# Altium schematic sheet MPU6050.SchDoc
size A4
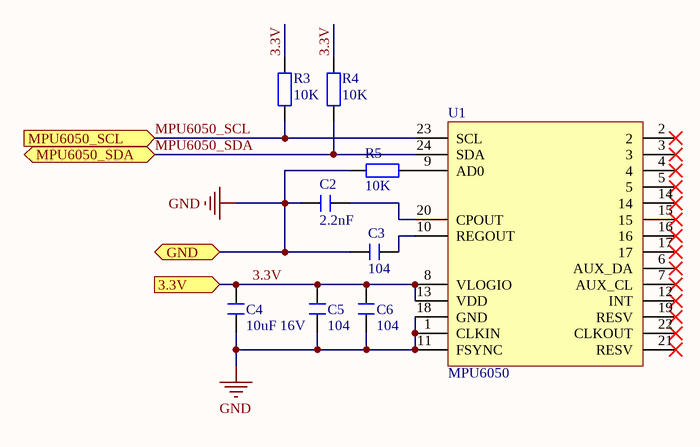
[diagram p0: MPU6050.SchDoc]

## Parts
C2  2.2nF  [C 0603_L]
C3  104  [C 0603_L]
C4  10uF 16V  [C 0603_L]
C5  104  [C 0603_L]
C6  104  [C 0603_L]
R3  10K  [R 0603_L]
R4  10K  [R 0603_L]
R5  10K  [R 0603_L]
U1  MPU6050  [QFN24 4x4_N]

## Ports
3.3V (in), GND, MPU6050_SCL (in), MPU6050_SDA

## Nets
GND: C2.1 C3.1 C4.2 C5.2 C6.2 R5.1 U1.1(CLKIN) U1.11(FSYNC) U1.18(GND) ; port GND
3.3V: C4.1 C5.1 C6.1 R3.1 R4.1 U1.8(VLOGIO) U1.13(VDD) ; port 3.3V
MPU6050_SCL: R3.2 U1.23(SCL) ; port MPU6050_SCL
MPU6050_SDA: R4.2 U1.24(SDA) ; port MPU6050_SDA
NetC2_2: C2.2 U1.20(CPOUT)
NetC3_2: C3.2 U1.10(REGOUT)
NetR5_2: R5.2 U1.9(AD0)

Not connected (* = marked no-connect by the designer): U1 2* 3* 4* 5* 6(AUX_DA)* 7(AUX_CL)* 12(INT)* 14* 15* 16* 17* 19(RESV)* 21(RESV)* 22(CLKOUT)*

## Library data of the parts
C2-C6 = C: 贴片电容; BOM名称: 无极性贴片电容; 优秀评价可免费更新: 联系淘宝ID：黄晶宝石，获取更新版封装库; 卖家免费技术支持，联系售后: 唯一出售店铺网址https://shop463601444.taobao.com; 本封装库来自淘宝卖家 ID：黄晶宝石: 其他店铺购入均为盗版，请立即申请退款
R3-R5 = R: 贴片电阻; 优秀评价可免费更新: 联系淘宝ID：黄晶宝石，获取更新版封装库; 卖家免费技术支持，联系售后: 唯一出售店铺网址https://shop463601444.taobao.com; 本封装库来自淘宝卖家 ID：黄晶宝石: 其他店铺购入均为盗版，请立即申请退款; BOM名称: 贴片电阻
U1 = MPU6050: 三轴加速度+三轴陀螺仪; 优秀评价可免费更新: 联系淘宝ID：黄晶宝石，获取更新版封装库; 卖家免费技术支持，联系售后: 唯一出售店铺网址https://shop463601444.taobao.com; 封装库来自淘宝卖家ID：黄晶宝石: 其他店铺购入均为假冒，请立即申请退款，本店奖励2~5元现金